# Altium project Practica RADAR.PrjPCB (part 1 of 3)
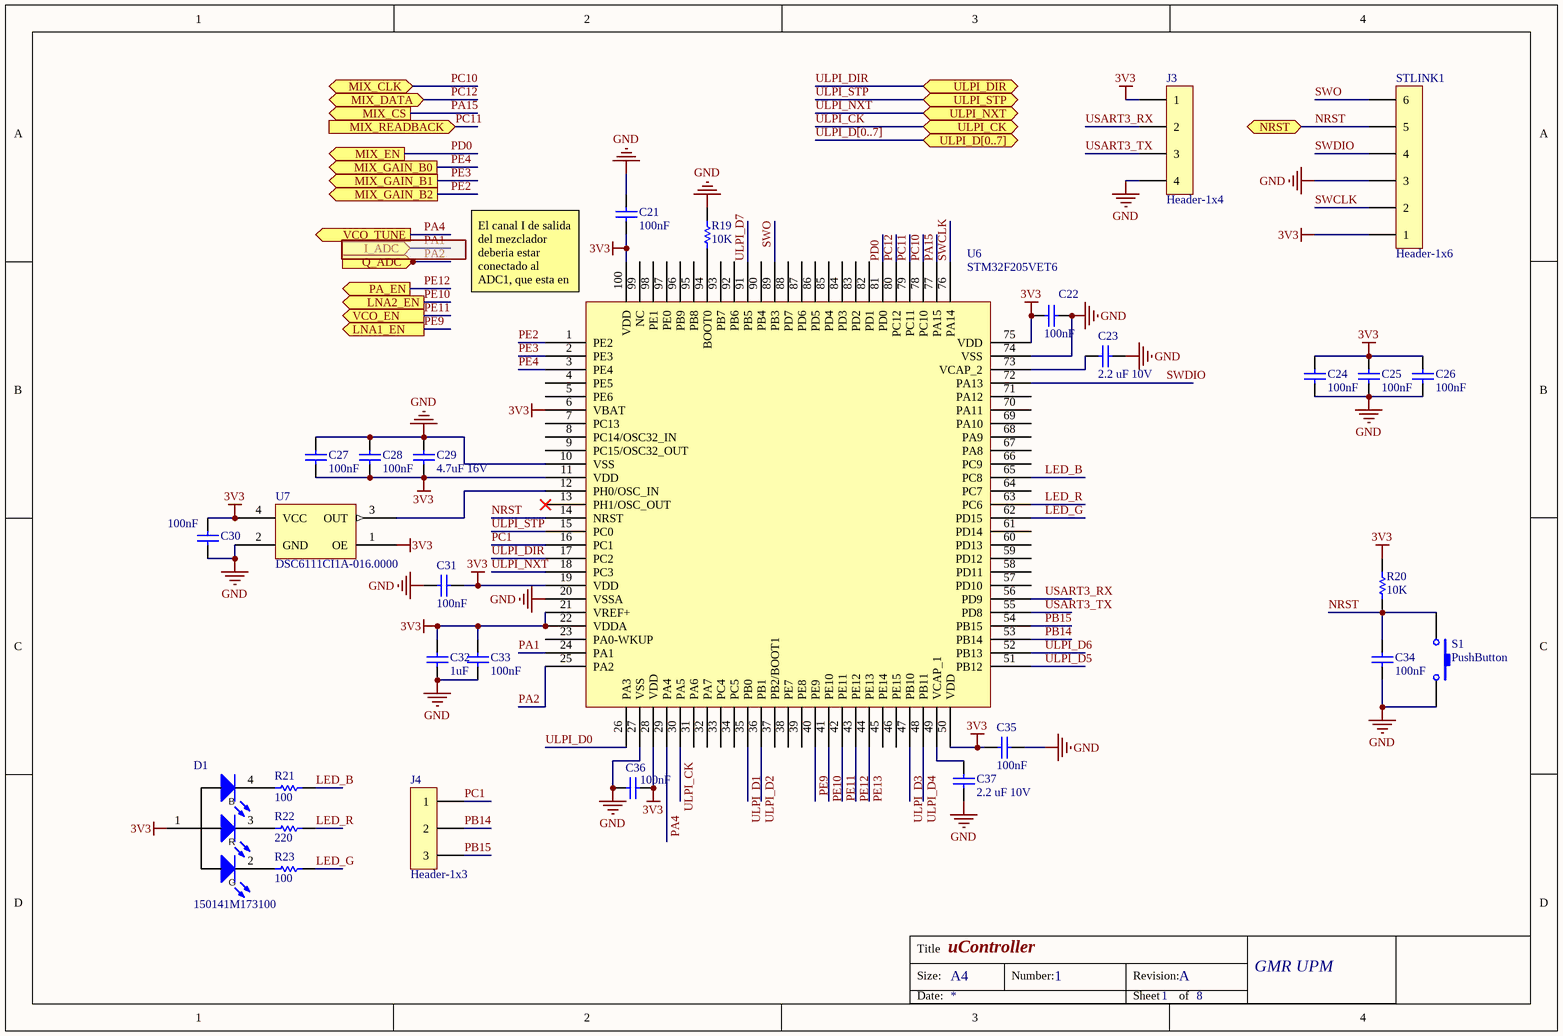
[diagram p0: uController.SchDoc]
Organization: GMR UPM; ProjectName: Practica Radar; Revision: A
8 sheets, 256 parts. Net scope: flat (ports and power ports of the same name join across sheets).
Board file: PCB_V2.PcbDoc
Sheets:
  uController.SchDoc
  Signal_RX.SchDoc
  Signal_TX.SchDoc
  USB PHY.SchDoc
  LowFreqSignal_V2.SchDoc
  Connectors.SchDoc
  SPI and enables.SchDoc
  Power.SchDoc

## Sheet uController.SchDoc: uController
size A4; Organization: GMR UPM; DocumentNumber: 1; Revision: A; SheetNumber: 1; SheetTotal: 8

### Parts
C21  100nF  [0603 Cap]
C22  100nF  [0603 Cap]
C23  2.2 uF 10V  [0603 Cap]
C24  100nF  [0603 Cap]
C25  100nF  [0603 Cap]
C26  100nF  [0603 Cap]
C27  100nF  [0603 Cap]
C28  100nF  [0603 Cap]
C29  4.7uF 16V  [0805 CAP]
C30  100nF  [0603 Cap]
C31  100nF  [0603 Cap]
C32  1uF  [0603 Cap]
C33  100nF  [0603 Cap]
C34  100nF  [0603 Cap]
C35  100nF  [0603 Cap]
C36  100nF  [0603 Cap]
C37  2.2 uF 10V  [0603 Cap]
D1  150141M173100  [DFN270P320X210-4N]
J3  Header-1x4  [HEADER-1X4]
J4  Header-1x3  [Header-1x3-Jumper]
R19  10K  [0603 Res]
R20  10K  [0603 Res]
R21  100  [RESC1005X04L]
R22  220  [RESC1005X04L]
R23  100  [RESC1005X04L]
S1  PushButton  [GH7643CT-ND]
STLINK1  Header-1x6  [Header-1x6]
U6  STM32F205VET6  [LQFP-100]
U7  DSC6111CI1A-016.0000  [DFN 3.2x2.5]

### Ports
I_ADC (in), LNA1_EN (out), LNA2_EN (out), MIX_CLK (bidir), MIX_CS (out), MIX_DATA (bidir), MIX_EN (out), MIX_GAIN_B0 (out), MIX_GAIN_B1 (out), MIX_GAIN_B2 (out), MIX_READBACK (in), NRST (bidir), PA_EN (out), Q_ADC (in), ULPI_CK (bidir), ULPI_D[0..7] (bidir), ULPI_DIR (bidir), ULPI_NXT (bidir), ULPI_STP (bidir), VCO_EN (out), VCO_TUNE (out)

### Nets
3V3: C21.2 C22.1 C24.2 C25.2 C26.2 C27.1 C28.1 C29.1 C30.2 C31.1 C32.2 C33.1 C35.2 C36.1 D1.1(A) J3.1 R20.2 STLINK1.1 U6.6(VBAT) U6.11(VDD) U6.19(VDD) U6.21(VREF+) U6.22(VDDA) U6.28(VDD) U6.50(VDD) U6.75(VDD) U6.100(VDD) U7.1(OE) U7.4(VCC)
GND: C21.1 C22.2 C23.1 C24.1 C25.1 C26.1 C27.2 C28.2 C29.2 C30.1 C31.2 C32.1 C33.2 C34.1 C35.1 C36.2 C37.1 J3.4 R19.2 S1.2 STLINK1.3 U6.10(VSS) U6.20(VSSA) U6.27(VSS) U6.74(VSS) U7.2(GND)
LED_B: R21.2 U6.65(PC8)
LED_G: R23.2 U6.62(PD15)
LED_R: R22.2 U6.63(PC6)
NRST: C34.2 R20.1 S1.1 STLINK1.5 U6.14(NRST) ; port NRST
PA1: U6.24(PA1) ; port I_ADC
PA2: U6.25(PA2) ; port Q_ADC
PA4: U6.29(PA4) ; port VCO_TUNE
PA15: U6.77(PA15) ; port MIX_CS
PB14: J4.2 U6.53(PB14)
PB15: J4.3 U6.54(PB15)
PC1: J4.1 U6.16(PC1)
PC10: U6.78(PC10) ; port MIX_CLK
PC11: U6.79(PC11) ; port MIX_READBACK
PC12: U6.80(PC12) ; port MIX_DATA
PD0: U6.81(PD0) ; port MIX_EN
PE2: U6.1(PE2) ; port MIX_GAIN_B2
PE3: U6.2(PE3) ; port MIX_GAIN_B1
PE4: U6.3(PE4) ; port MIX_GAIN_B0
PE9: U6.40(PE9) ; port LNA1_EN
PE10: U6.41(PE10) ; port LNA2_EN
PE11: U6.42(PE11) ; port VCO_EN
PE12: U6.43(PE12) ; port PA_EN
PE13: U6.44(PE13)
SWCLK: STLINK1.2 U6.76(PA14)
SWDIO: STLINK1.4 U6.72(PA13)
SWO: STLINK1.6 U6.89(PB3)
ULPI_CK: U6.30(PA5) ; port ULPI_CK
ULPI_D0: U6.26(PA3)
ULPI_D1: U6.35(PB0)
ULPI_D2: U6.36(PB1)
ULPI_D3: U6.47(PB10)
ULPI_D4: U6.48(PB11)
ULPI_D5: U6.51(PB12)
ULPI_D6: U6.52(PB13)
ULPI_D7: U6.91(PB5)
ULPI_DIR: U6.17(PC2) ; port ULPI_DIR
ULPI_NXT: U6.18(PC3) ; port ULPI_NXT
ULPI_STP: U6.15(PC0) ; port ULPI_STP
USART3_RX: J3.2 U6.56(PD9)
USART3_TX: J3.3 U6.55(PD8)
NetC23_2: C23.2 U6.73(VCAP_2)
NetC37_2: C37.2 U6.49(VCAP_1)
NetD1_2: D1.2(C) R23.1
NetD1_3: D1.3(C) R22.1
NetD1_4: D1.4(C) R21.1
NetR19_1: R19.1 U6.94(BOOT0)
NetU6_12: U6.12(PH0/OSC_IN) U7.3(OUT)

Not connected (* = marked no-connect by the designer): U6 4(PE5) 5(PE6) 7(PC13) 8(PC14/OSC32_IN) 9(PC15/OSC32_OUT) 13(PH1/OSC_OUT)* 23(PA0-WKUP) 31(PA6) 32(PA7) 33(PC4) 34(PC5) 37(PB2/BOOT1) 38(PE7) 39(PE8) 45(PE14) 46(PE15) 57(PD10) 58(PD11) 59(PD12) 60(PD13) 61(PD14) 64(PC7) 66(PC9) 67(PA8) 68(PA9) 69(PA10) 70(PA11) 71(PA12) 82(PD1) 83(PD2) 84(PD3) 85(PD4) 86(PD5) 87(PD6) 88(PD7) 90(PB4) 92(PB6) 93(PB7) 95(PB8) 96(PB9) 97(PE0) 98(PE1) 99(NC)

### Buses and harness runs
bus ULPI_D[0..7] = port ULPI_D[0..7]

### Notes on the sheet
- (near U6) El canal I de salida del mezclador deberia estar conectado al ADC1, que esta en el pin PC1
- Title
- Size:
- A4
- Number:
- Revision:
- Date:
- Sheet
- of
- (in symbol 150141M173100) B; R; G

### Library data of the parts
C21 C22 C24-C28 C30 C31 C33-C36 = C0603C104K4RACTU: CAP CER 0.1UF 16V X7R 0603; Manufacturer: KEMET; Capacitance: 0.1µF; Tolerance: ±10%; Supplier 1: Digi-Key; Manufacturer Part Number: C0603C104K4RACTU; RoHS: RoHS Compliant; Category: Capacitors; Stock 1: 4491346; Pricing 1: 1=0.09, 10=0.022, 25=0.016, 50=0.0122, 100=0.01, 250=0.00836, 500=0.0071, 1000=0.00559 (EUR); Packaging: Digi-Reel®; Part Status: Active; Voltage - Rated: 16V; Temperature Coefficient: X7R; Operating Temperature: -55°C ~ 125°C; Features: -; Ratings: -; Applications: General Purpose; Failure Rate: -; Mounting Type: Surface Mount, MLCC; Package / Case: 0603 (1608 Metric); Size / Dimension: 0.063" L x 0.031" W (1.60mm x 0.80mm); Height - Seated (Max): -; Thickness (Max): 0.034" (0.87mm); Lead Spacing: -; Lead Style: -; ComponentLink1URL: http://www.kemet.com/docfinder?Partnumber=C0603C104K4RACTU; ComponentLink1Description: http://www.kemet.com/docfinder?Partnumber=C0603C104K4RACTU; Supplier Part Number 1: 399-1096-6-ND
C23 C37 = CL10B225KP8NNNC: CAP CER 2.2UF 10V X7R 0603; Manufacturer: Samsung Electro-Mechanics America, Inc.; Capacitance: 2.2µF; Tolerance: ±10%; Supplier 1: Digi-Key; Manufacturer Part Number: CL10B225KP8NNNC; RoHS: RoHS Compliant; Category: Capacitors; Stock 1: 226342; Pricing 1: 1=0.15, 10=0.105, 25=0.0764, 50=0.0592, 100=0.0491, 250=0.04068, 500=0.03444, 1000=0.02851 (EUR); Packaging: Digi-Reel®; Part Status: Active; Voltage - Rated: 10V; Temperature Coefficient: X7R; Operating Temperature: -55°C ~ 125°C; Features: -; Ratings: -; Applications: General Purpose; Mounting Type: Surface Mount, MLCC; Package / Case: 0603 (1608 Metric); Size / Dimension: 0.063" L x 0.031" W (1.60mm x 0.80mm); Height - Seated (Max): -; Thickness (Max): 0.035" (0.90mm); Lead Spacing: -; Lead Style: -; ComponentLink1URL: http://www.samsungsem.com/kr/support/product-search/mlcc/__icsFiles/afieldfile/2016/08/18/S_CL10B225KP8NNNC.pdf; ComponentLink1Description: http://www.samsungsem.com/kr/support/product-search/mlcc/__icsFiles/afieldfile/2016/08/18/S_CL10B225KP8NNNC.pdf; Supplier Part Number 1: 1276-1134-6-ND
C29 = GRM21BR71C475KE51L: CAP CER 4.7UF 16V X7R 0805; Manufacturer: Murata Electronics North America; Capacitance: 4.7µF; Tolerance: ±10%; Supplier 1: Digi-Key; Manufacturer Part Number: GRM21BR71C475KE51L; RoHS: RoHS Compliant; Category: Capacitors; Stock 1: 5810; Pricing 1: 1=0.16, 10=0.111, 25=0.0816, 50=0.0666, 100=0.0562, 250=0.04588, 500=0.03848, 1000=0.03403 (EUR); Part Status: Active; Voltage - Rated: 16V; Temperature Coefficient: X7R; Operating Temperature: -55°C ~ 125°C; Features: -; Ratings: -; Applications: General Purpose; Failure Rate: -; Mounting Type: Surface Mount, MLCC; Package / Case: 0805 (2012 Metric); Size / Dimension: 0.079" L x 0.049" W (2.00mm x 1.25mm); Height - Seated (Max): -; Thickness (Max): 0.055" (1.40mm); Lead Spacing: -; Lead Style: -; Supplier Part Number 1: 490-14466-6-ND
C32 = CL10B105MO8NNWC: CAP CER 1UF 16V X7R 0603; Manufacturer: Samsung Electro-Mechanics America, Inc.; Capacitance: 1µF; Tolerance: ±20%; Supplier 1: Digi-Key; Manufacturer Part Number: CL10B105MO8NNWC; RoHS: RoHS Compliant; Category: Capacitors; Stock 1: 77746; Pricing 1: 1=0.09, 10=0.02, 25=0.0144, 50=0.0108, 100=0.0089, 250=0.00744, 500=0.00636, 1000=0.00499 (EUR); Packaging: Digi-Reel®; Part Status: Active; Voltage - Rated: 16V; Temperature Coefficient: X7R; Operating Temperature: -55°C ~ 125°C; Features: -; Ratings: -; Applications: General Purpose; Mounting Type: Surface Mount, MLCC; Package / Case: 0603 (1608 Metric); Size / Dimension: 0.063" L x 0.031" W (1.60mm x 0.80mm); Height - Seated (Max): -; Thickness (Max): 0.035" (0.90mm); Lead Spacing: -; Lead Style: -; ComponentLink1URL: http://www.samsungsem.com/kr/support/library/product-catalog/__icsFiles/afieldfile/2016/09/27/MLCC.pdf; ComponentLink1Description: http://www.samsungsem.com/kr/support/library/product-catalog/__icsFiles/afieldfile/2016/09/27/MLCC.pdf; Supplier Part Number 1: 1276-6524-6-ND
D1 = 150141M173100: LED RGB CLEAR 1411 SMD; Manufacturer: Wurth Electronics Inc.; Color: Red, Green, Blue (RGB); Configuration: Common Anode; Lens Color: Colorless; Millicandela Rating: 270mcd Red, 950mcd Green, 230mcd Blue; Lens Style/Size: Round with Flat Top, 2.40mm; Voltage - Forward (Vf) (Typ): 2V Red, 3.2V Green, 3.2V Blue; Current - Test: 20mA Red, 20mA Green, 20mA Blue; Viewing Angle: 120°; Wavelength - Dominant: 625nm Red, 520nm Green, 470nm Blue; Wavelength - Peak: 635nm Red, 515nm Green, 465nm Blue; Supplier 1: Digi-Key; Manufacturer Part Number: 150141M173100; RoHS: RoHS Compliant; Category: Optoelectronics; Stock 1: 7809; Pricing 1: 1=0.4, 100=0.3462, 500=0.2867 (EUR); Packaging: Cut Tape (CT); Part Status: Active; Lens Transparency: Clear; Mounting Type: Surface Mount; Features: -; Package / Case: 1411 (3528 Metric); Supplier Device Package: 3528; Size / Dimension: 3.50mm L x 2.80mm W; Height (Max): 2.10mm; ComponentLink1URL: http://katalog.we-online.de/led/datasheet/150141M173100.pdf; ComponentLink1Description: http://katalog.we-online.de/led/datasheet/150141M173100.pdf; Supplier Part Number 1: 732-4998-1-ND
R19 R20 = RC0603FR-0710KL: RES SMD 10K OHM 1% 1/10W 0603; Manufacturer: Yageo; Power (Watts): 0.1W, 1/10W; Temperature Coefficient: ±100ppm/°C; Supplier 1: Digi-Key; Manufacturer Part Number: RC0603FR-0710KL; RoHS: RoHS Compliant; Category: Resistors; Stock 1: 17023109; Pricing 1: 1=0.09, 10=0.012, 25=0.0088, 50=0.0066, 100=0.0049, 250=0.00372, 500=0.00296, 1000=0.00218 (EUR); Packaging: Cut Tape (CT); Part Status: Active; Resistance (Ohms): 10k; Tolerance: ±1%; Composition: Thick Film; Features: Moisture Resistant; Operating Temperature: -55°C ~ 155°C; Package / Case: 0603 (1608 Metric); Supplier Device Package: 0603; Size / Dimension: 0.063" L x 0.031" W (1.60mm x 0.80mm); Height - Seated (Max): 0.022" (0.55mm); Failure Rate: -; ComponentLink1URL: http://www.yageo.com/documents/recent/PYu-RC_Group_51_RoHS_L_7.pdf; ComponentLink1Description: http://www.yageo.com/documents/recent/PYu-RC_Group_51_RoHS_L_7.pdf; Supplier Part Number 1: 311-10.0KHRCT-ND
R21 R23 = MCR01MRTF1000: RES 100 OHM 1/16W 1% 0402 SMD; Manufacturer: Rohm Semiconductor; Power (Watts): 0.063W, 1/16W; Temperature Coefficient: ±100ppm/°C; Supplier 1: Digi-Key; Supplier Part Number 1: RHM100CDCT-ND; Manufacturer Part Number: MCR01MRTF1000; RoHS: RoHS Compliant; Category: Resistors; Stock 1: 128227; Pricing 1: 1=0.09, 10=0.011, 25=0.008, 100=0.0046, 250=0.00348, 500=0.00278, 1000=0.00205, 5000=0.00147 (EUR); Packaging: Cut Tape (CT); Resistance (Ohms): 100; Tolerance: ±1%; Composition: Thick Film; Features: -; Operating Temperature: -55°C ~ 155°C; Package / Case: 0402 (1005 Metric); Supplier Device Package: 0402 (1005 Metric); Size / Dimension: 0.039" L x 0.020" W (1.00mm x 0.50mm); Height: 0.016" (0.40mm); Number of Terminations: 2; ComponentLink1URL: http://rohmfs.rohm.com/en/products/databook/datasheet/passive/resistor/chip_resistor/mcr_g.pdf; ComponentLink1Description: http://rohmfs.rohm.com/en/products/databook/datasheet/passive/resistor/chip_resistor/mcr_g.pdf
R22 = RC0402FR-07220RL: RES SMD 220 OHM 1% 1/16W 0402; Manufacturer: Yageo; Power (Watts): 0.063W, 1/16W; Temperature Coefficient: ±100ppm/°C; Supplier 1: Digi-Key; Manufacturer Part Number: RC0402FR-07220RL; RoHS: RoHS Compliant; Category: Resistors; Stock 1: 624682; Pricing 1: 1=0.09, 10=0.011, 25=0.0084, 50=0.0062, 100=0.0046, 250=0.00348, 500=0.00278, 1000=0.00205, 5000=0.00147 (EUR); Packaging: Cut Tape (CT); Part Status: Active; Resistance (Ohms): 220; Tolerance: ±1%; Composition: Thick Film; Features: Moisture Resistant; Operating Temperature: -55°C ~ 155°C; Package / Case: 0402 (1005 Metric); Supplier Device Package: 0402; Size / Dimension: 0.039" L x 0.020" W (1.00mm x 0.50mm); Height - Seated (Max): 0.016" (0.40mm); Number of Terminations: 2; Failure Rate: -; ComponentLink1URL: http://www.yageo.com/NewPortal/yageodocoutput?fileName=/pdf/R-Chip/PYu-RC_Group_51_RoHS_L_4.pdf; ComponentLink1Description: http://www.yageo.com/NewPortal/yageodocoutput?fileName=/pdf/R-Chip/PYu-RC_Group_51_RoHS_L_4.pdf; Supplier Part Number 1: 311-220LRCT-ND
S1 = PushButton_95C04A3GWRT: SWITCH TACTILE SPST-NO 0.05A 12V; Manufacturer: Grayhill Inc.; Switch Function: Off-Mom; Contact Rating @ Voltage: 0.05A @ 12VDC; Actuator Type: Rectangular Button; Actuator Height off PCB, Vertical: 4.30mm; Actuator Orientation: Top Actuated; Outline: 6.00mm x 3.50mm; Illumination: Non-Illuminated; Operating Force: 160gf; Actuator Material: Polyamide (PA), Nylon; Switch Travel: 0.25mm; Mechanical Life: 50,000 Cycles; Supplier 1: Digi-Key; Manufacturer Part Number: 95C04A3GWRT; RoHS: RoHS Compliant; Category: Switches; Stock 1: 3272; Pricing 1: 1=0.38, 10=0.363, 25=0.3556, 50=0.3424, 100=0.2954, 250=0.26852, 500=0.2551 (EUR); Packaging: Cut Tape (CT); Part Status: Active; Circuit: SPST-NO; Mounting Type: Surface Mount; Actuator Length, Right Angle: -; Termination Style: Gull Wing; Illumination Type, Color: -; Illumination Voltage (Nominal): -; Ingress Protection: -; Features: Tactile Feedback; Operating Temperature: -25°C ~ 70°C; ComponentLink1URL: http://www.grayhill.com/assets/1/7/Tact_95C04.pdf; ComponentLink1Description: http://www.grayhill.com/assets/1/7/Tact_95C04.pdf; Supplier Part Number 1: GH7643CT-ND
U6 = STM32F205VET6: IC MCU 32BIT 512KB FLASH 100LQFP; Manufacturer: STMicroelectronics; Core Processor: ARM® Cortex®-M3; Core Size: 32-Bit; Speed: 120MHz; Connectivity: CAN, I²C, IrDA, LIN, MMC, SPI, UART/USART, USB OTG; Peripherals: Brown-out Detect/Reset, DMA, I²S, LCD, POR, PWM, WDT; Number of I/O: 82; Program Memory Size: 512KB (512K x 8); RAM Size: 132K x 8; Voltage - Supply (Vcc/Vdd): 1.8 V ~ 3.6 V; Data Converters: A/D 16x12b; D/A 2x12b; Oscillator Type: Internal; Supplier 1: Digi-Key; Manufacturer Part Number: STM32F205VET6; RoHS: RoHS Compliant; Category: Integrated Circuits (ICs); Stock 1: 1188; Pricing 1: 1=9.78, 10=8.83, 100=7.3108, 500=6.36612, 1000=5.54468 (EUR); Packaging: Tray; Part Status: Active; Program Memory Type: FLASH; EEPROM Size: -; Operating Temperature: -40°C ~ 85°C (TA); Package / Case: 100-LQFP; Supplier Device Package: 100-LQFP (14x14); ComponentLink1URL: http://media.digikey.com/pdf/Data%20Sheets/ST%20Microelectronics%20PDFS/STM32F20(5,7)xx.pdf; ComponentLink1Description: http://media.digikey.com/pdf/Data%20Sheets/ST%20Microelectronics%20PDFS/STM32F20(5,7)xx.pdf; Supplier Part Number 1: 497-11160-ND
U7 = DSC6111CI1A-016.0000: ULTRA-LOW POWER,MEMS OSCILLATOR,; Manufacturer: Microchip Technology; Frequency: 16MHz; Function: Standby (Power Down); Output: CMOS; Voltage - Supply: 1.71 V ~ 3.63 V; Frequency Stability: ±25ppm; Current - Supply (Max): 3mA (Typ); Current - Supply (Disable) (Max): 10.5µA; Supplier 1: Digi-Key; Manufacturer Part Number: DSC6111CI1A-016.0000; RoHS: RoHS Compliant; Category: Crystals, Oscillators, Resonators; Stock 1: 957; Pricing 1: 1=0.81, 25=0.6744, 100=0.6514 (EUR); Packaging: Tube; Part Status: Active; Type: MEMS (Silicon); Operating Temperature: -40°C ~ 85°C; Ratings: AEC-Q100; Mounting Type: Surface Mount; Package / Case: 4-SMD, No Lead; Size / Dimension: 0.126" L x 0.098" W (3.20mm x 2.50mm); Height - Seated (Max): 0.035" (0.90mm); ComponentLink1URL: http://www.microchip.com/mymicrochip/filehandler.aspx?ddocname=en587492; ComponentLink1Description: http://www.microchip.com/mymicrochip/filehandler.aspx?ddocname=en587492; Supplier Part Number 1: DSC6111CI1A-016.0000-ND

## Sheet Signal_RX.SchDoc: Signal_RX
size A4; Organization: GMR UPM; DocumentNumber: 2; Revision: A; SheetNumber: 2; SheetTotal: 8
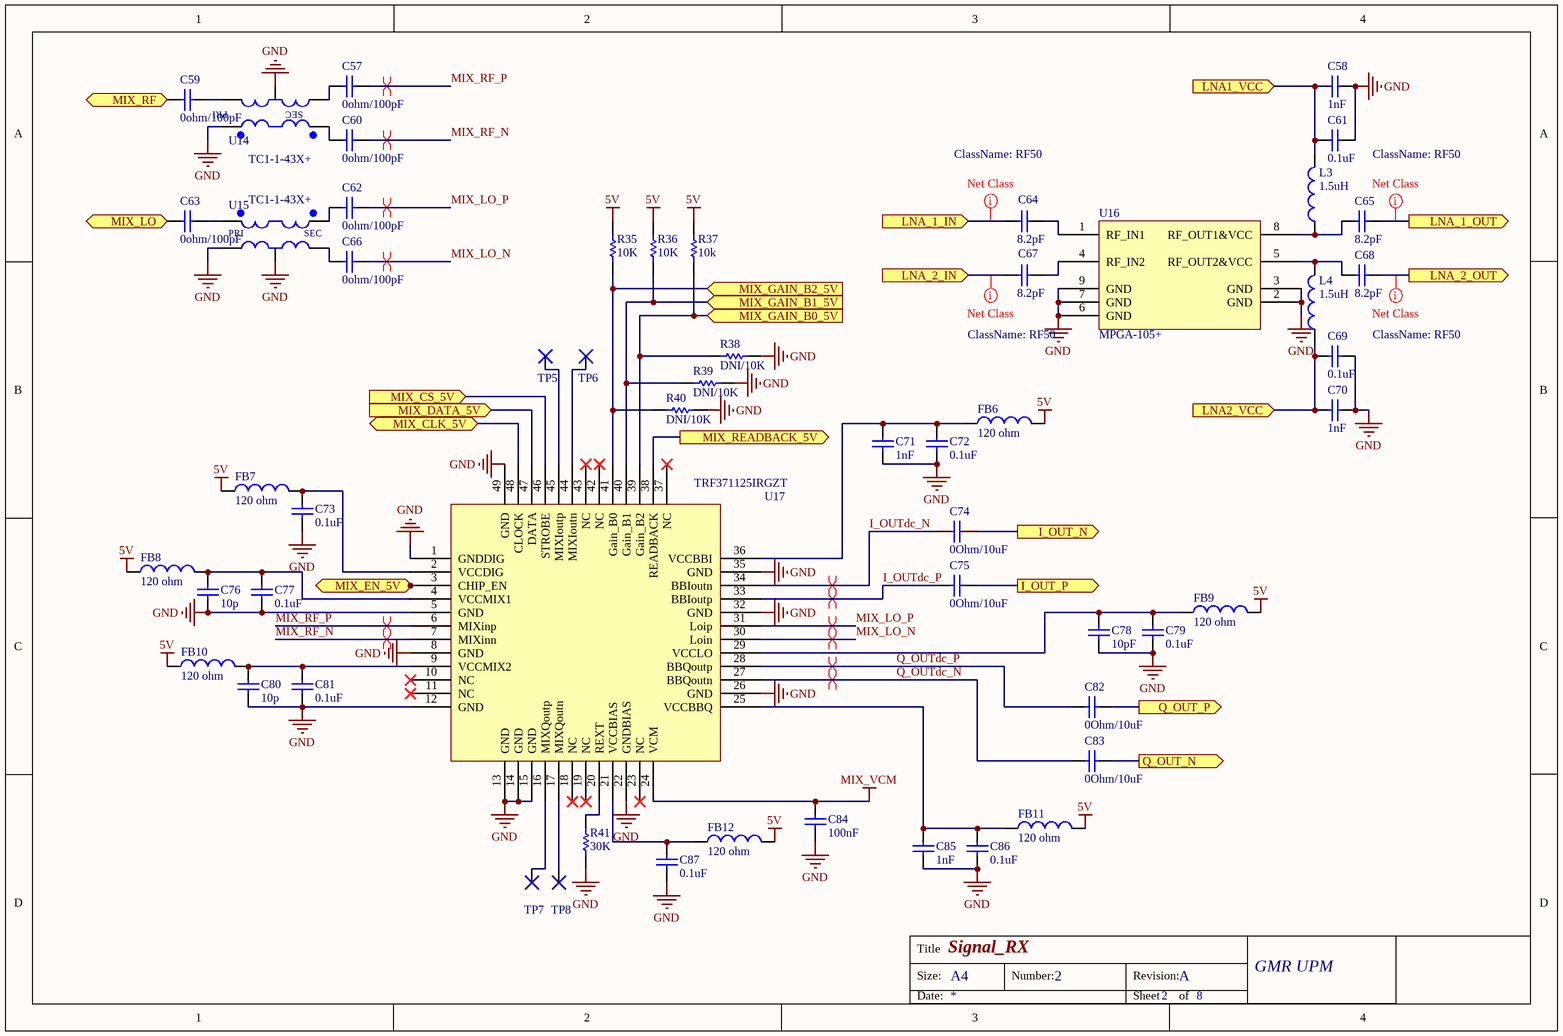
[diagram p1: Signal_RX.SchDoc]

### Parts
C57  0ohm/100pF  [0603 Cap]
C58  1nF  [0603 Cap]
C59  0ohm/100pF  [0603 Cap]
C60  0ohm/100pF  [0603 Cap]
C61  0.1uF  [0603 Cap]
C62  0ohm/100pF  [0603 Cap]
C63  0ohm/100pF  [0603 Cap]
C64  8.2pF  [Chip2PinSM127P600-8N_CAP0402]
C65  8.2pF  [Chip2PinSM127P600-8N_CAP0402]
C66  0ohm/100pF  [0603 Cap]
C67  8.2pF  [Chip2PinSM127P600-8N_CAP0402]
C68  8.2pF  [Chip2PinSM127P600-8N_CAP0402]
C69  0.1uF  [0603 Cap]
C70  1nF  [0603 Cap]
C71  1nF  [0603 Cap]
C72  0.1uF  [0603 Cap]
C73  0.1uF  [0603 Cap]
C74  0Ohm/10uF  [0603 Cap]
C75  0Ohm/10uF  [0603 Cap]
C76  10p  [0603 Cap]
C77  0.1uF  [0603 Cap]
C78  10pF  [0603 Cap]
C79  0.1uF  [0603 Cap]
C80  10p  [0603 Cap]
C81  0.1uF  [0603 Cap]
C82  0Ohm/10uF  [0603 Cap]
C83  0Ohm/10uF  [0603 Cap]
C84  100nF  [0603 Cap]
C85  1nF  [0603 Cap]
C86  0.1uF  [0603 Cap]
C87  0.1uF  [0603 Cap]
FB6  120 ohm  [INDC1608X08L]
FB7  120 ohm  [INDC1608X08L]
FB8  120 ohm  [INDC1608X08L]
FB9  120 ohm  [INDC1608X08L]
FB10  120 ohm  [INDC1608X08L]
FB11  120 ohm  [INDC1608X08L]
FB12  120 ohm  [INDC1608X08L]
L3  1.5uH  [INDC1008X07L]
L4  1.5uH  [INDC1008X07L]
R35  10K  [0603 Res]
R36  10K  [0603 Res]
R37  10k  [0603 Res]
R38  DNI/10K  [0603 Res]
R39  DNI/10K  [0603 Res]
R40  DNI/10K  [0603 Res]
R41  30K  [0603 Res]
TP5  TEST_POINT_PIN  [TESTPOINT]  (value not drawn)  (no BOM)
TP6  TEST_POINT_PIN  [TESTPOINT]  (value not drawn)  (no BOM)
TP7  TEST_POINT_PIN  [TESTPOINT]  (value not drawn)  (no BOM)
TP8  TEST_POINT_PIN  [TESTPOINT]  (value not drawn)  (no BOM)
U14  TC1-1-43X+  [AT1521]
U15  TC1-1-43X+  [AT1521]
U16  MPGA-105+  [DL1020_recomendedValues]
U17  TRF371125IRGZT  [QFN50P700X700X100_HS-49M]

### Ports
I_OUT_N (out), I_OUT_P (out), LNA1_VCC (in), LNA2_VCC (in), LNA_1_IN (in), LNA_1_OUT (out), LNA_2_IN (in), LNA_2_OUT (out), MIX_CLK_5V (bidir), MIX_CS_5V (in), MIX_DATA_5V (in), MIX_EN_5V (in), MIX_GAIN_B0_5V (in), MIX_GAIN_B1_5V (in), MIX_GAIN_B2_5V (in), MIX_LO (in), MIX_READBACK_5V (out), MIX_RF (in), Q_OUT_N (out), Q_OUT_P (out)

### Nets
5V: FB6.1 FB7.1 FB8.1 FB9.1 FB10.1 FB11.1 FB12.1 R35.2 R36.2 R37.2
GND: C58.1 C61.1 C69.2 C70.2 C71.2 C72.2 C73.1 C76.1 C77.1 C78.2 C79.2 C80.1 C81.1 C84.2 C85.2 C86.2 C87.2 R38.1 R39.1 R40.1 R41.1 U14.2(NC) U14.6 U15.2(NC) U15.4 U16.2(GND) U16.3(GND) U16.6(GND) U16.7(GND) U16.9(GND) U17.1(GNDDIG) U17.5(GND) U17.8(GND) U17.12(GND) U17.13(GND) U17.14(GND) U17.15(GND) U17.22(GNDBIAS) U17.26(GND) U17.32(GND) U17.35(GND) U17.49(GND)
MIX_VCM: C84.1 U17.24(VCM)
I_OUT_N: C74.1 ; port I_OUT_N
I_OUT_P: C75.1 ; port I_OUT_P
I_OUTdc_N: C74.2 U17.34(BBIoutn)
I_OUTdc_P: C75.2 U17.33(BBIoutp)
LNA1_VCC: C58.2 C61.2 L3.2 ; port LNA1_VCC
LNA2_VCC: C69.1 C70.1 L4.2 ; port LNA2_VCC
LNA_1_IN: C64.1 ; port LNA_1_IN
LNA_1_OUT: C65.2 ; port LNA_1_OUT
LNA_2_IN: C67.1 ; port LNA_2_IN
LNA_2_OUT: C68.2 ; port LNA_2_OUT
MIX_CLK_5V: U17.48(CLOCK) ; port MIX_CLK_5V
MIX_CS_5V: U17.46(STROBE) ; port MIX_CS_5V
MIX_DATA_5V: U17.47(DATA) ; port MIX_DATA_5V
MIX_GAIN_B0_5V: R37.1 R38.2 U17.39(Gain_B2) ; port MIX_GAIN_B0_5V
MIX_GAIN_B1_5V: R36.1 R39.2 U17.40(Gain_B1) ; port MIX_GAIN_B1_5V
MIX_GAIN_B2_5V: R35.1 R40.2 U17.41(Gain_B0) ; port MIX_GAIN_B2_5V
MIX_LO: C63.1 ; port MIX_LO
MIX_LO_N: C66.2 U17.30(Loin)
MIX_LO_P: C62.2 U17.31(Loip)
MIX_READBACK_5V: U17.38(READBACK) ; port MIX_READBACK_5V
MIX_RF: C59.1 ; port MIX_RF
MIX_RF_N: C60.2 U17.7(MIXinn)
MIX_RF_P: C57.2 U17.6(MIXinp)
Q_OUT_N: C83.1 ; port Q_OUT_N
Q_OUT_P: C82.1 ; port Q_OUT_P
Q_OUTdc_N: C83.2 U17.27(BBQoutn)
Q_OUTdc_P: C82.2 U17.28(BBQoutp)
NetC57_1: C57.1 U14.3
NetC59_2: C59.2 U14.4
NetC60_1: C60.1 U14.1
NetC62_1: C62.1 U15.1
NetC63_2: C63.2 U15.6
NetC64_2: C64.2 U16.1(RF_IN1)
NetC65_1: C65.1 L3.1 U16.8(RF_OUT1&VCC)
NetC66_1: C66.1 U15.3
NetC67_2: C67.2 U16.4(RF_IN2)
NetC68_1: C68.1 L4.1 U16.5(RF_OUT2&VCC)
NetC71_1: C71.1 C72.1 FB6.2 U17.36(VCCBBI)
NetC73_2: C73.2 FB7.2 U17.2(VCCDIG)
NetC76_2: C76.2 C77.2 FB8.2 U17.4(VCCMIX1)
NetC78_1: C78.1 C79.1 FB9.2 U17.29(VCCLO)
NetC80_2: C80.2 C81.2 FB10.2 U17.9(VCCMIX2)
NetC85_1: C85.1 C86.1 FB11.2 U17.25(VCCBBQ)
NetC87_1: C87.1 FB12.2 U17.21(VCCBIAS)
NetR41_2: R41.2 U17.20(REXT)
NetTP5_1: TP5.1 U17.45(MIXIoutp)
NetTP6_1: TP6.1 U17.44(MIXIoutn)
NetTP7_1: TP7.1 U17.16(MIXQoutp)
NetTP8_1: TP8.1 U17.17(MIXQoutn)

Not connected (* = marked no-connect by the designer): U17 3(CHIP_EN) 10(NC)* 11(NC)* 18(NC)* 19(NC)* 23(NC)* 37(NC)* 42(NC)* 43(NC)*

### Layout directives
differential pair: I_OUTdc_N, I_OUTdc_P, MIX_LO_N, MIX_LO_P, MIX_RF_N, MIX_RF_P, Q_OUTdc_N, Q_OUTdc_P
net class RF50: LNA_1_IN, LNA_1_OUT, LNA_2_IN, LNA_2_OUT

### Notes on the sheet
- Title
- Size:
- A4
- Number:
- Revision:
- Date:
- Sheet
- of
- (in symbol TC1-1-43X+) PRI; SEC

### Library data of the parts
C57-C63 C66 C69-C87 = C_0603: CAP CER 16V X7R 0603; Tolerance: 10; Voltage Rating: 16; Material: Ceramic; Mount: Surface Mount; Case/Package: 0603; Case Code (Metric): 1608; Case Code (Imperial): 0603; Capacitance: *; Dielectric: X7R; Voltage Rating (DC): 16; Termination: SMD; Composition: Ceramic; Voltage: 16; Length: 1.6; Height: 0.8; Width: 0.8; Thickness: 0.035; Depth: 0.8
C64 C65 C67 C68 = 04025A8R2BAT2A: CAP CER 8.2PF 50V NP0 0402; Manufacturer: AVX Corporation; Tolerance: ±0.1pF; Temperature Coefficient: C0G, NP0; Notification: Current market demand for these product types have resulted in fluctuating and extending lead times. Lead times may differ.; Supplier 1: Digi-Key; Manufacturer Part Number: 04025A8R2BAT2A; RoHS: RoHS Compliant; Category: Capacitors; Stock 1: 20781; Pricing 1: 1=0.09, 10=0.046, 100=0.0204, 500=0.0146, 1000=0.01148, 2500=0.01043, 5000=0.0096 (EUR); Packaging: Cut Tape (CT); Part Status: Active; Voltage - Rated: 50V; Operating Temperature: -55°C ~ 125°C; Features: -; Ratings: -; Applications: General Purpose; Failure Rate: -; Mounting Type: Surface Mount, MLCC; Package / Case: 0402 (1005 Metric); Size / Dimension: 0.039" L x 0.020" W (1.00mm x 0.50mm); Height - Seated (Max): -; Thickness (Max): 0.022" (0.56mm); Lead Spacing: -; Lead Style: -; ComponentLink1URL: http://datasheets.avx.com/C0GNP0-Dielectric.pdf; ComponentLink1Description: http://datasheets.avx.com/C0GNP0-Dielectric.pdf; Supplier Part Number 1: 478-10785-1-ND
FB6-FB12 = BLM18PG121SN1D: FERRITE BEAD 120 OHM 0603 1LN; Manufacturer: Murata Electronics North America; Filter Type: Power Line; Number of Lines: 1; Impedance @ Frequency: 120 Ohm @ 100MHz; Current Rating (Max): 2A; DC Resistance (DCR) (Max): 50 mOhm; Supplier 1: Digi-Key; Manufacturer Part Number: BLM18PG121SN1D; RoHS: RoHS Compliant; Category: Filters; Stock 1: 1305577; Pricing 1: 1=0.09, 10=0.067, 25=0.06, 50=0.0438, 100=0.038, 250=0.02996, 500=0.0253, 1000=0.02132 (EUR); Packaging: Cut Tape (CT); Part Status: Active; Ratings: -; Operating Temperature: -55°C ~ 125°C; Package / Case: 0603 (1608 Metric); Mounting Type: Surface Mount; Height (Max): 0.037" (0.95mm); Size / Dimension: 0.063" L x 0.031" W (1.60mm x 0.80mm); ComponentLink1URL: http://www.murata.com/en-us/products/productdata/8796738650142/ENFA0003.pdf; ComponentLink1Description: http://www.murata.com/en-us/products/productdata/8796738650142/ENFA0003.pdf; Supplier Part Number 1: 490-1037-1-ND
L3 L4 = AISC-1008F-1R5G-T: FIXED IND 1.5UH 630MA 760 MOHM; Manufacturer: Abracon LLC; Type: Wirewound; Material - Core: Ferrite; Tolerance: ±2%; Shielding: Unshielded; DC Resistance (DCR): 760 mOhm Max; Q @ Freq: 35 @ 50MHz; Frequency - Self Resonant: 190MHz; Supplier 1: Digi-Key; Manufacturer Part Number: AISC-1008F-1R5G-T; RoHS: RoHS Compliant; Category: Inductors, Coils, Chokes; Stock 1: 42157; Pricing 1: 1=0.31, 10=0.275, 100=0.189, 500=0.16152, 1000=0.12372 (EUR); Packaging: Cut Tape (CT); Part Status: Active; Current - Saturation: -; Ratings: -; Operating Temperature: -40°C ~ 85°C; Mounting Type: Surface Mount; Package / Case: 1008 (2520 Metric); Supplier Device Package: 1008 (2520 Metric); Size / Dimension: 0.115" L x 0.110" W (2.92mm x 2.79mm); Height - Seated (Max): 0.090" (2.29mm); ComponentLink1URL: https://abracon.com/Magnetics/new/AISC-1008F(L).pdf; ComponentLink1Description: https://abracon.com/Magnetics/new/AISC-1008F(L).pdf; Supplier Part Number 1: AISC-1008F-1R5G-TCT-ND
R35-R41 = R_0603: SMD Resistor, 1%, 0.1W, 0603; Tolerance: 1; Power Rating: 100; Mount: Surface Mount; Case/Package: 0603; Pins: 2; Case Code (Imperial): 0603; Case Code (Metric): 1608; Termination: SMD; Length: 1.6; Height: 0.45; Width: 0.8; Depth: 0.8
TP5-TP8 = TEST_POINT_PIN: Test point for single pin
U14 U15 = TC1-1-43X+: SMD RF Transformer; Manufacturer: Minicircuits; Manufacturer Part Number: TC1-1-43X+; Supplier: Aicox
U16 = MPGA-105+: Dual Matched MMIC Ampli er; Manufacturer: Minicircuits; Manufacturer Part Number: MPGA-105+; Supplier: Aicox
U17 = TRF371125IRGZT: IC IQ DEMODULATOR W/PGA 48VQFN; Manufacturer: Texas Instruments; Function: Demodulator, Amplifier; LO Frequency: 700MHz ~ 4GHz; P1dB: 3dBm; Gain: 40dB; Noise Figure: 13.5dB; Voltage - Supply: 4.5 V ~ 5.5 V; Supplier 1: Digi-Key; Manufacturer Part Number: TRF371125IRGZT; RoHS: RoHS Compliant; Category: RF/IF and RFID; Stock 1: 1365; Pricing 1: 1=22.67, 10=20.922, 25=19.1784, 100=17.7254 (EUR); Packaging: Cut Tape (CT); Part Status: Active; RF Frequency: 700MHz ~ 4GHz; Package / Case: 48-VFQFN Exposed Pad; Supplier Device Package: 48-VQFN (7x7); ComponentLink1URL: http://www.ti.com/lit/ds/symlink/trf371125.pdf; ComponentLink1Description: http://www.ti.com/lit/ds/symlink/trf371125.pdf; Supplier Part Number 1: 296-25654-1-ND; Supplier: Aicox

## Sheet Signal_TX.SchDoc: Signal_TX
size A4; Organization: GMR UPM; DocumentNumber: 3; SheetNumber: 3; SheetTotal: 8
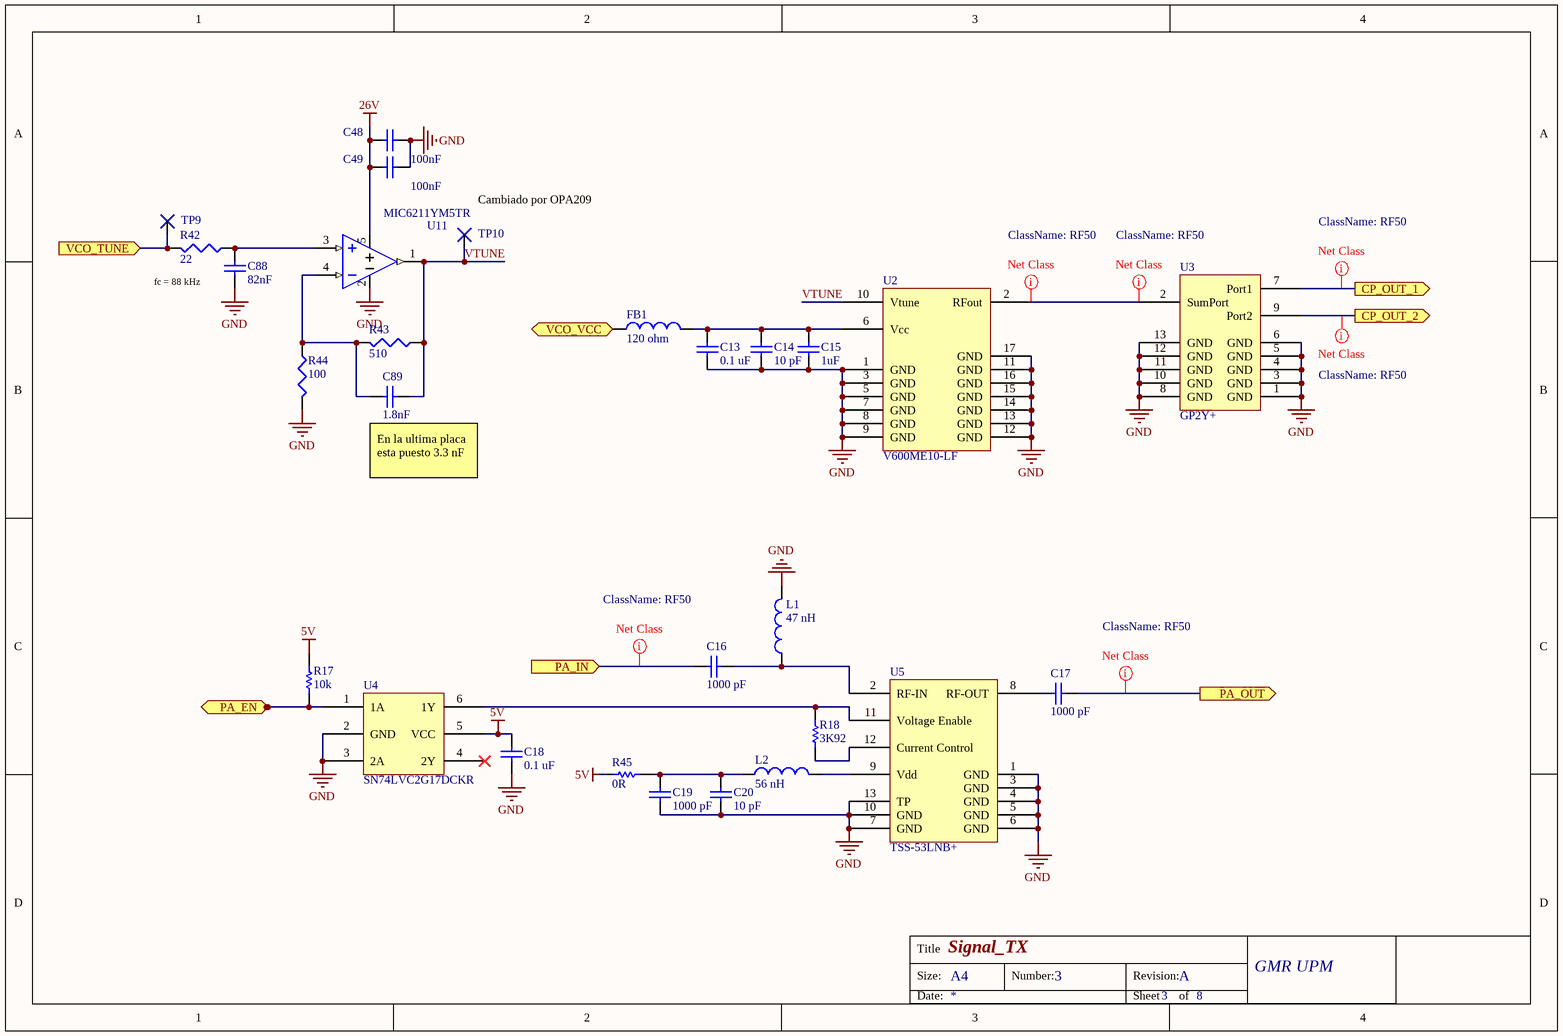
[diagram p2: Signal_TX.SchDoc]

### Parts
C13  0.1 uF  [0603 Cap]
C14  10 pF  [CAPC1005X05L]
C15  1uF  [0603 Cap]
C16  1000 pF  [CAPC1005X05L]
C17  1000 pF  [CAPC1005X05L]
C18  0.1 uF  [0603 Cap]
C19  1000 pF  [CAPC1005X05L]
C20  10 pF  [CAPC1005X05L]
C48  100nF  [0603 Cap]
C49  100nF  [0603 Cap]
C88  82nF  [0603 Cap]
C89  1.8nF  [0603 Cap]
FB1  120 ohm  [INDC1608X08L]
L1  47 nH  [INDC1005X07L]
L2  56 nH  [INDC1005X07L]
R17  10k  [0603 Res]
R18  3K92  [0603 Res]
R42  22  [J1-0603]
R43  510  [J1-0603]
R44  100  [J1-0603]
R45  0R  [0603 Res]
TP9  TEST_POINT_PIN  [TESTPOINT]  (value not drawn)  (no BOM)
TP10  TEST_POINT_PIN  [TESTPOINT]  (value not drawn)  (no BOM)
U2  V600ME10-LF  [CK605]
U3  GP2Y+  [DQ1225]
U4  SN74LVC2G17DCKR  [DCK (R-PDSO-G6)]
U5  TSS-53LNB+  [DQ1225]
U11  MIC6211YM5TR  [SOT95P280X90-5N2]

### Ports
CP_OUT_1 (out), CP_OUT_2 (out), PA_EN (in), PA_IN (in), PA_OUT (out), VCO_TUNE (in), VCO_VCC (in)

### Nets
5V: C18.2 R17.2 R45.2 U4.5(VCC)
26V: C48.2 C49.2 U11.5(V+)
GND: C13.1 C14.1 C15.1 C18.1 C19.1 C20.1 C48.1 C49.1 C88.1 L1.2 R44.2 U2.1(GND) U2.3(GND) U2.5(GND) U2.7(GND) U2.8(GND) U2.9(GND) U2.11(GND) U2.12(GND) U2.13(GND) U2.14(GND) U2.15(GND) U2.16(GND) U2.17(GND) U3.1(GND) U3.3(GND) U3.4(GND) U3.5(GND) U3.6(GND) U3.8(GND) U3.10(GND) U3.11(GND) U3.12(GND) U3.13(GND) U4.2(GND) U4.3(2A) U5.1(GND) U5.3(GND) U5.4(GND) U5.5(GND) U5.6(GND) U5.7(GND) U5.10(GND) U5.13(TP) U11.2(V-)
CP_OUT_1: U3.7(Port1) ; port CP_OUT_1
CP_OUT_2: U3.9(Port2) ; port CP_OUT_2
PA4: R42.2 TP9.1 ; port VCO_TUNE
PA_IN: C16.1 ; port PA_IN
PA_OUT: C17.1 ; port PA_OUT
PE12: R17.1 U4.1(1A) ; port PA_EN
VCO_VCC: FB1.2 ; port VCO_VCC
VTUNE: C89.1 R43.1 TP10.1 U2.10(Vtune) U11.1(OUTA)
NetC13_2: C13.2 C14.2 C15.2 FB1.1 U2.6(Vcc)
NetC16_2: C16.2 L1.1 U5.2(RF-IN)
NetC17_2: C17.2 U5.8(RF-OUT)
NetC19_2: C19.2 C20.2 L2.1 R45.1
NetC88_2: C88.2 R42.1 U11.3(IN+)
NetC89_2: C89.2 R43.2 R44.1 U11.4(IN-)
NetL2_2: L2.2 U5.9(Vdd)
NetR18_1: R18.1 U5.12(Current_Control)
NetR18_2: R18.2 U4.6(1Y) U5.11(Voltage_Enable)
NetU2_2: U2.2(RFout) U3.2(SumPort)

Not connected (* = marked no-connect by the designer): U4 4(2Y)*

### Layout directives
net class RF50: CP_OUT_1, CP_OUT_2, NetU2_2, PA_IN, PA_OUT

### Notes on the sheet
- (near TP10) Cambiado por OPA209
- fc = 88 kHz
- (near C89) En la ultima placa esta puesto 3.3 nF
- Title
- Size:
- A4
- Number:
- Revision:
- Date:
- Sheet
- of

### Library data of the parts
C13 C18 = CC0603KRX7R7BB104: CAP CER 0.1UF 16V X7R 0603; Manufacturer: Yageo; Tolerance: 10; Capacitance: 100; Voltage Rating: 16; Min Temperature: -55; Material: Ceramic; Supplier 1: Digikey; Manufacturer Part Number: CC0603KRX7R7BB104; Stock 1: 2351469; Pricing 1: 1=0.1, 10=0.019, 25=0.014, 50=0.0104, 100=0.0085, 250=0.0071, 500=0.0061, 1000=0.0048 (USD); Mount: Surface Mount; Case/Package: 0603; Pins: 2; Case Code (Metric): 1608; Case Code (Imperial): 0603; Min Operating Temperature: -55; Max Operating Temperature: 125; Dielectric: X7R; Voltage Rating (DC): 16; Package Quantity: 4000; Packaging: Tape and Reel; Termination: SMD; Composition: Ceramic; Voltage: 16; Length: 1.6; Height: 0.8; Width: 0.8; Thickness: 0.035; Depth: 0.8; Radiation Hardening: No; REACH SVHC: No SVHC; ComponentLink1URL: https://datasheet.ciiva.com/11786/0900766b80d84f1d-11786077.pdf; ComponentLink1Description: https://datasheet.ciiva.com/11786/0900766b80d84f1d-11786077.pdf; ComponentLink2URL: https://datasheet.ciiva.com/15165/getdatasheetpartid-63554-15165387.pdf; ComponentLink2Description: https://datasheet.ciiva.com/15165/getdatasheetpartid-63554-15165387.pdf; ComponentLink3URL: https://datasheet.ciiva.com/13395/upy-gphc-x7r-6-3v-to-50v-8-13395674.pdf; ComponentLink3Description: https://datasheet.ciiva.com/13395/upy-gphc-x7r-6-3v-to-50v-8-13395674.pdf; ComponentLink4URL: https://datasheet.ciiva.com/46430/1734573-46430156.pdf; ComponentLink4Description: https://datasheet.ciiva.com/46430/1734573-46430156.pdf; ComponentLink5URL: https://datasheet.ciiva.com/11464/upy-gphc-x7r-6-3v-to-50v-8-11464735.pdf; ComponentLink5Description: https://datasheet.ciiva.com/11464/upy-gphc-x7r-6-3v-to-50v-8-11464735.pdf; ComponentLink6URL: https://datasheet.ciiva.com/7978/1489800-7978141.pdf; ComponentLink6Description: https://datasheet.ciiva.com/7978/1489800-7978141.pdf; ComponentLink7URL: https://datasheet.ciiva.com/28450/1489800-28450552.pdf; ComponentLink7Description: https://datasheet.ciiva.com/28450/1489800-28450552.pdf; ComponentLink8URL: https://datasheet.ciiva.com/16625/upy-gphc-x7r-6-3v-to-50v-8-16625526.pdf; ComponentLink8Description: https://datasheet.ciiva.com/16625/upy-gphc-x7r-6-3v-to-50v-8-16625526.pdf; ComponentLink9URL: https://datasheet.ciiva.com/144/mlccorderingcode-144182.pdf; ComponentLink9Description: https://datasheet.ciiva.com/144/mlccorderingcode-144182.pdf; ComponentLink10URL: https://datasheet.ciiva.com/8033/1734573-8033797.pdf; ComponentLink10Description: https://datasheet.ciiva.com/8033/1734573-8033797.pdf; ComponentLink11URL: https://datasheet.ciiva.com/144/mlccorderingcode-144184.pdf; ComponentLink11Description: https://datasheet.ciiva.com/144/mlccorderingcode-144184.pdf; ComponentLink12URL: https://datasheet.ciiva.com/8033/70765-8033799.pdf; ComponentLink12Description: https://datasheet.ciiva.com/8033/70765-8033799.pdf; ComponentLink13URL: https://datasheet.ciiva.com/144/mlccorderingcode-144183.pdf; ComponentLink13Description: https://datasheet.ciiva.com/144/mlccorderingcode-144183.pdf; Supplier Part Number 1: 311-1088-1-ND
C14 C20 = CL05C100JB5NNNC: CAP CER 10PF 50V 5% NP0 0402; Manufacturer: Samsung Electro-Mechanics America, Inc; Temperature Coefficient: C0G, NP0; Supplier 1: Digi-Key; Supplier Part Number 1: 1276-1139-1-ND; Manufacturer Part Number: CL05C100JB5NNNC; RoHS: RoHS Compliant; Category: Capacitors; Stock 1: 376482; Pricing 1: 1=0.09, 10=0.011, 25=0.008, 100=0.0052, 500=0.00366, 1000=0.00285, 2500=0.00256, 5000=0.00238 (EUR); Packaging: Cut Tape (CT); Capacitance: 10pF; Tolerance: ±5%; Voltage - Rated: 50V; Mounting Type: Surface Mount, MLCC; Operating Temperature: -55°C ~ 125°C; Applications: General Purpose; Ratings: -; Package / Case: 0402 (1005 Metric); Size / Dimension: 0.039" L x 0.020" W (1.00mm x 0.50mm); Height - Seated (Max): -; Thickness (Max): 0.022" (0.55mm); Lead Spacing: -; Features: -; Lead Style: -; ComponentLink1URL: http://www.samsungsem.com/servlet/FileDownload?type=spec&file=CL05C100JB5NNNC.pdf; ComponentLink1Description: http://www.samsungsem.com/servlet/FileDownload?type=spec&file=CL05C100JB5NNNC.pdf
C15 = CL10B105MO8NNWC: as C32 on sheet uController; Supplier 1: Digi-Key; Manufacturer Part Number: CL10B105MO8NNWC; RoHS: RoHS Compliant; Category: Capacitors; Stock 1: 77746; Pricing 1: 1=0.09, 10=0.02, 25=0.0144, 50=0.0108, 100=0.0089, 250=0.00744, 500=0.00636, 1000=0.00499 (EUR); Packaging: Digi-Reel®; Part Status: Active; Voltage - Rated: 16V; Temperature Coefficient: X7R; Operating Temperature: -55°C ~ 125°C; Features: -; Ratings: -; Applications: General Purpose; Mounting Type: Surface Mount, MLCC; Package / Case: 0603 (1608 Metric); Size / Dimension: 0.063" L x 0.031" W (1.60mm x 0.80mm); Height - Seated (Max): -; Thickness (Max): 0.035" (0.90mm); Lead Spacing: -; Lead Style: -; ComponentLink1URL: http://www.samsungsem.com/kr/support/library/product-catalog/__icsFiles/afieldfile/2016/09/27/MLCC.pdf; ComponentLink1Description: http://www.samsungsem.com/kr/support/library/product-catalog/__icsFiles/afieldfile/2016/09/27/MLCC.pdf; Supplier Part Number 1: 1276-6524-6-ND
C16 C17 C19 = CL05C102JA5NNNC: CAP CER 1000PF 25V 5% NP0 0402; Manufacturer: Samsung Electro-Mechanics America, Inc; Manufacturer Part Number: CL05C102JB5NNNC; Voltage - Rated: 50V; Temperature Coefficient: C0G, NP0; Supplier 1: Digi-Key; Supplier Part Number 1: 1276-1635-1-ND; RoHS: RoHS Compliant; Category: Capacitors; Stock 1: 50559; Pricing 1: 1=0.09, 10=0.053, 25=0.0372, 100=0.0242, 500=0.01694, 1000=0.0132, 2500=0.01188, 5000=0.011 (EUR); Packaging: Cut Tape (CT); Capacitance: 1000pF; Tolerance: ±5%; Mounting Type: Surface Mount, MLCC; Operating Temperature: -55°C ~ 125°C; Applications: General Purpose; Ratings: -; Package / Case: 0402 (1005 Metric); Size / Dimension: 0.039" L x 0.020" W (1.00mm x 0.50mm); Height - Seated (Max): -; Thickness (Max): 0.022" (0.55mm); Lead Spacing: -; Features: -; Lead Style: -; ComponentLink1URL: http://www.samsungsem.com/servlet/FileDownload?type=spec&file=CL05C102JB5NNNC.pdf; ComponentLink1Description: http://www.samsungsem.com/servlet/FileDownload?type=spec&file=CL05C102JB5NNNC.pdf
C48 C49 C88 C89 = C0603C104K4RACTU: as C21 on sheet uController; Supplier 1: Digi-Key; Manufacturer Part Number: C0603C104K4RACTU; RoHS: RoHS Compliant; Category: Capacitors; Stock 1: 4491346; Pricing 1: 1=0.09, 10=0.022, 25=0.016, 50=0.0122, 100=0.01, 250=0.00836, 500=0.0071, 1000=0.00559 (EUR); Packaging: Digi-Reel®; Part Status: Active; Voltage - Rated: 16V; Temperature Coefficient: X7R; Operating Temperature: -55°C ~ 125°C; Features: -; Ratings: -; Applications: General Purpose; Failure Rate: -; Mounting Type: Surface Mount, MLCC; Package / Case: 0603 (1608 Metric); Size / Dimension: 0.063" L x 0.031" W (1.60mm x 0.80mm); Height - Seated (Max): -; Thickness (Max): 0.034" (0.87mm); Lead Spacing: -; Lead Style: -; ComponentLink1URL: http://www.kemet.com/docfinder?Partnumber=C0603C104K4RACTU; ComponentLink1Description: http://www.kemet.com/docfinder?Partnumber=C0603C104K4RACTU; Supplier Part Number 1: 399-1096-6-ND
FB1 = BLM18PG121SN1D: as FB6 on sheet Signal_RX; Supplier 1: Digi-Key; Manufacturer Part Number: BLM18PG121SN1D; RoHS: RoHS Compliant; Category: Filters; Stock 1: 1305577; Pricing 1: 1=0.09, 10=0.067, 25=0.06, 50=0.0438, 100=0.038, 250=0.02996, 500=0.0253, 1000=0.02132 (EUR); Packaging: Cut Tape (CT); Part Status: Active; Ratings: -; Operating Temperature: -55°C ~ 125°C; Package / Case: 0603 (1608 Metric); Mounting Type: Surface Mount; Height (Max): 0.037" (0.95mm); Size / Dimension: 0.063" L x 0.031" W (1.60mm x 0.80mm); ComponentLink1URL: http://www.murata.com/en-us/products/productdata/8796738650142/ENFA0003.pdf; ComponentLink1Description: http://www.murata.com/en-us/products/productdata/8796738650142/ENFA0003.pdf; Supplier Part Number 1: 490-1037-1-ND
L1 = 0402CS-47NXGLU: COILCRAFT - 0402CS-47NXGLU - INDUCTOR, RF, 47NH, 2%, 2.1GHZ, SMD; Supplier 1: Farnell; Manufacturer: COILCRAFT; Manufacturer Part Number: 0402CS-47NXGLU; RoHS: Y-EX; Stock 1: 477; Pricing 1: 1=1,18, 10=1,06, 50=0,89, 100=0,829, 200=0,79, 500=0,529, 1000=0,418 (EUR); ComponentLink1URL: http://www.farnell.com/datasheets/1681871.pdf; ComponentLink1Description: http://www.farnell.com/datasheets/1681871.pdf; Supplier Part Number 1: 2285690
L2 = 0402CS-56NXJLU: Fixed Inductors 0402CS HiFreq Chip 56 nH 5 % 0.1 A; Manufacturer: Coilcraft; Core Material: Ceramic; Maximum DC Current: 100 mA; Maximum DC Resistance: 970 mOhms; Q Minimum: 42; Self Resonant Frequency: 1.76 GHz; Tolerance: 5 %; Test Frequency: 250 MHz; Supplier 1: Mouser; Manufacturer Part Number: 0402CS-56NXJLU; RoHS: RoHS Compliant; Category: Fixed Inductors; Stock 1: 2095; Pricing 1: 1=1.29, 10=1.12, 50=0.914, 100=0.839, 200=0.793, 500=0.500, 1000=0.367, 2000=0.340 (EUR); Height: 0.66 mm; Inductance: 56 nH; Length: 1.19 mm; Operating Temperature Range: - 40 C to + 125 C; Package/Case: 0402 (1005 metric); Packaging: Reel; Product: RF Inductors; Series: 0402CS; Termination Style: SMD/SMT; Width: 0.64 mm; Brand: Coilcraft; Mounting Style: SMD/SMT; Standard Pack Qty: 200; RoHS - Mouser: Y; Minimum Order Quantity: 1; Reeling: True; ComponentLink1URL: http://www.mouser.com/ds/2/597/0402cs-253326.pdf; ComponentLink1Description: http://www.mouser.com/ds/2/597/0402cs-253326.pdf; Supplier Part Number 1: 994-0402CS-56NXJLU
R17 R18 R45 = R_0603: as R35 on sheet Signal_RX; Mount: Surface Mount; Case/Package: 0603; Pins: 2; Case Code (Imperial): 0603; Case Code (Metric): 1608; Termination: SMD; Length: 1.6; Height: 0.45; Width: 0.8; Depth: 0.8
R42-R44 = Res3: Resistor; Published: 8-Jun-2000; LatestRevisionDate: 29-May-2009; LatestRevisionNote: IPC-7351 Footprint Added.; PackageReference: J1-0603; Publisher: Altium Limited; PackageDescription: Chip Resistor
TP9 TP10 = TEST_POINT_PIN: Test point for single pin
U2 = V600ME10-LF: Voltage-Controlled Oscillator SMD; Manufacturer: ZCOMM; Manufacturer Part Number: V600ME10-LF; Supplier: Monolitic
U3 = GP2Y+: Power Splitter/Combiner; Manufacturer: Minicircuits; Manufacturer Part Number: GP2Y+; Supplier: Aicox
U4 = SN74LVC2G17DCKR: IC BUF NON-INVERT 5.5V SC70-6; Manufacturer: Texas Instruments; Logic Type: Buffer, Non-Inverting; Number of Bits per Element: 1; Input Type: Schmitt Trigger; Output Type: Push-Pull; Current - Output High, Low: 32mA, 32mA; Voltage - Supply: 1.65 V ~ 5.5 V; Supplier 1: Digi-Key; Manufacturer Part Number: SN74LVC2G17DCKR; RoHS: RoHS Compliant; Category: Integrated Circuits (ICs); Stock 1: 76967; Pricing 1: 1=0.47, 10=0.399, 100=0.298, 500=0.2341, 1000=0.18089 (EUR); Packaging: Cut Tape (CT); Part Status: Active; Operating Temperature: -40°C ~ 125°C (TA); Mounting Type: Surface Mount; Package / Case: 6-TSSOP, SC-88, SOT-363; Supplier Device Package: SC-70-6; Base Part Number: 74LVC2G17; ComponentLink1URL: http://www.ti.com/lit/ds/symlink/sn74lvc2g17.pdf; ComponentLink1Description: http://www.ti.com/lit/ds/symlink/sn74lvc2g17.pdf; Supplier Part Number 1: 296-13013-1-ND
U5 = TSS-53LNB+: Low Noise Bypass Amplier; Manufacturer: Minicircuits; Manufacturer Part Number: TSS-53LNB+; Supplier: Aicox
U11 = MIC6211YM5TR: IC OPAMP GP 2.5MHZ SOT23-5; Manufacturer: Microchip Micrel; Input Offset Voltage-Max: 7 mV; No of Channels: 1; Slew Rate-Nom: 6 V/µs; Supply Voltage-Max: 32 V; Supplier 1: Digi-Key; Manufacturer Part Number: MIC6211YM5TR; Stock 1: 6526; Pricing 1: 1=0.32, 25=0.268, 100=0.2472 (USD); Gain Bandwidth-Nom: 2.5 MHz; ComponentLink1URL: https://datasheet.ciiva.com/1796/mic6211-1796048.pdf; ComponentLink1Description: https://datasheet.ciiva.com/1796/mic6211-1796048.pdf; ComponentLink2URL: https://datasheet.ciiva.com/5825/94475-5825392.pdf; ComponentLink2Description: https://datasheet.ciiva.com/5825/94475-5825392.pdf; ComponentLink3URL: https://datasheet.ciiva.com/1796/mic6211-1796049.pdf; ComponentLink3Description: https://datasheet.ciiva.com/1796/mic6211-1796049.pdf; ComponentLink4URL: https://datasheet.ciiva.com/1796/mic6211-1796050.pdf; ComponentLink4Description: https://datasheet.ciiva.com/1796/mic6211-1796050.pdf; ComponentLink5URL: https://datasheet.ciiva.com/13061/mic6211-13061502.pdf; ComponentLink5Description: https://datasheet.ciiva.com/13061/mic6211-13061502.pdf; Supplier Part Number 1: 576-1314-1-ND